# Altium project 48V-BuckConverter.PrjPcb
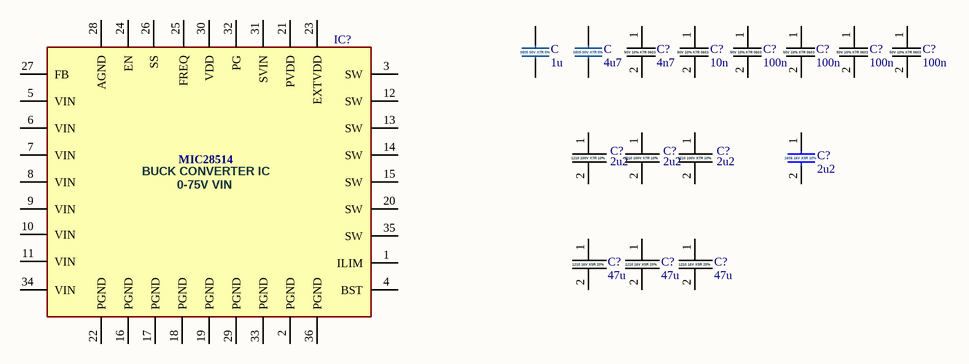
[diagram p0: BuckConverter-Main.SchDoc]
1 sheet, 16 parts. Net scope: global (net labels, ports and power ports of the same name join across sheets).

## Sheet BuckConverter-Main.SchDoc
size A4; SheetNumber: 1; SheetTotal: 1

### Parts
(Parts that share a designator on the sheet are numbered #1, #2 ... from top to bottom, then left to right.)
C#1  1u  [CAPC2012X95N]
C#2  4u7  [CAPC2012X95N]
C?#1  4n7  [C0603]
C?#2  10n  [C0603]
C?#3  100n  [C0603]
C?#4  100n  [C0603]
C?#5  100n  [C0603]
C?#6  100n  [C0603]
C?#7  2u2  [C1210]
C?#8  2u2  [C1210]
C?#9  2u2  [C1210]
C?#10  2u2  [CAPC1608X80N]
C?#11  47u  [C1210]
C?#12  47u  [C1210]
C?#13  47u  [C1210]
IC?  MIC28514  [MIC28514TEPHA]

### Nets

Not connected (* = marked no-connect by the designer): C#1 1 2; C#2 1 2; C?#1 1 2; C?#2 1 2; C?#3 1 2; C?#4 1 2; C?#5 1 2; C?#6 1 2; C?#7 1 2; C?#8 1 2; C?#9 1 2; C?#10 1 2; C?#11 1 2; C?#12 1 2; C?#13 1 2; IC? 1(ILIM) 2(PGND) 3(SW) 4(BST) 5(VIN) 6(VIN) 7(VIN) 8(VIN) 9(VIN) 10(VIN) 11(VIN) 12(SW) 13(SW) 14(SW) 15(SW) 16(PGND) 17(PGND) 18(PGND) 19(PGND) 20(SW) 21(PVDD) 22(PGND) 23(EXTVDD) 24(EN) 25(FREQ) 26(SS) 27(FB) 28(AGND) 29(PGND) 30(VDD) 31(SVIN) 32(PG) 33(PGND) 34(VIN) 35(SW) 36(PGND)

### Notes on the sheet
- (in symbol 0805-CAP) 0805 50V X7R 5%
- (in symbol C0603C472K5RACTU) 50V 10% X7R 0603
- (in symbol C1210C220J5GACTU) 1210 100V X7R 10%; 1210 16V X5R 20%
- (in symbol C1608X5R0J225K080AB) 1608 16V X5R 10%
- (in symbol MIC28514) BUCK CONVERTER IC; 0-75V VIN

### Library data of the parts
C#1 = 0805-CAP: C2012X7S2A105K125AB; Manufacturer_Name: YAGEO; Manufacturer_Part_Number: CC0805JRX7R9BB104; Datasheet Link: https://www.yageo.com/upload/media/product/productsearch/datasheet/mlcc/UPY-GPHC_X7R_6.3V-to-250V_23.pdf; Height: 0.95mm; Mouser Part Number: 603-CC805JRX7R9BB104; Mouser Price/Stock: https://www.mouser.co.uk/ProductDetail/YAGEO/CC0805JRX7R9BB104?qs=5q%252BqlK8CmJSDpHT%2Fzz27hw%3D%3D; Arrow Part Number: CC0805JRX7R9BB104; Arrow Price/Stock: https://www.arrow.com/en/products/cc0805jrx7r9bb104/yageo?utm_currency=USD&region=nac
C#2 = 0805-CAP: C2012X5R1E475M125AB; Manufacturer_Name: YAGEO; Manufacturer_Part_Number: CC0805JRX7R9BB104; Datasheet Link: https://www.yageo.com/upload/media/product/productsearch/datasheet/mlcc/UPY-GPHC_X7R_6.3V-to-250V_23.pdf; Height: 0.95mm; Mouser Part Number: 603-CC805JRX7R9BB104; Mouser Price/Stock: https://www.mouser.co.uk/ProductDetail/YAGEO/CC0805JRX7R9BB104?qs=5q%252BqlK8CmJSDpHT%2Fzz27hw%3D%3D; Arrow Part Number: CC0805JRX7R9BB104; Arrow Price/Stock: https://www.arrow.com/en/products/cc0805jrx7r9bb104/yageo?utm_currency=USD&region=nac
C?#1 = C0603C472K5RACTU: Manufacturer_Name: KEMET; Datasheet Link: https://content.kemet.com/datasheets/KEM_C1002_X7R_SMD.pdf; Height: 0.87mm; Manufacturer_Part_Number: C0603C472K5RACTU; Mouser Part Number: 80-C0603C472K5R; Mouser Price/Stock: https://www.mouser.co.uk/ProductDetail/KEMET/C0603C472K5RACTU?qs=PKwhJV00DjVWo4q%252BGYORqA%3D%3D; Arrow Part Number: C0603C472K5RACTU; Arrow Price/Stock: https://www.arrow.com/en/products/c0603c472k5ractu/kemet-corporation?region=nac
C?#2 = C0603C472K5RACTU: CC0603KRX7R8BB103; Manufacturer_Name: KEMET; Datasheet Link: https://content.kemet.com/datasheets/KEM_C1002_X7R_SMD.pdf; Height: 0.87mm; Manufacturer_Part_Number: C0603C472K5RACTU; Mouser Part Number: 80-C0603C472K5R; Mouser Price/Stock: https://www.mouser.co.uk/ProductDetail/KEMET/C0603C472K5RACTU?qs=PKwhJV00DjVWo4q%252BGYORqA%3D%3D; Arrow Part Number: C0603C472K5RACTU; Arrow Price/Stock: https://www.arrow.com/en/products/c0603c472k5ractu/kemet-corporation?region=nac
C?#3 = C0603C472K5RACTU: 0603YC104KAT2A; Manufacturer_Name: KEMET; Datasheet Link: https://content.kemet.com/datasheets/KEM_C1002_X7R_SMD.pdf; Height: 0.87mm; Manufacturer_Part_Number: C0603C472K5RACTU; Mouser Part Number: 80-C0603C472K5R; Mouser Price/Stock: https://www.mouser.co.uk/ProductDetail/KEMET/C0603C472K5RACTU?qs=PKwhJV00DjVWo4q%252BGYORqA%3D%3D; Arrow Part Number: C0603C472K5RACTU; Arrow Price/Stock: https://www.arrow.com/en/products/c0603c472k5ractu/kemet-corporation?region=nac
C?#4-C?#6 = C0603C472K5RACTU: GRM188R72A104KA35D; Manufacturer_Name: KEMET; Datasheet Link: https://content.kemet.com/datasheets/KEM_C1002_X7R_SMD.pdf; Height: 0.87mm; Manufacturer_Part_Number: C0603C472K5RACTU; Mouser Part Number: 80-C0603C472K5R; Mouser Price/Stock: https://www.mouser.co.uk/ProductDetail/KEMET/C0603C472K5RACTU?qs=PKwhJV00DjVWo4q%252BGYORqA%3D%3D; Arrow Part Number: C0603C472K5RACTU; Arrow Price/Stock: https://www.arrow.com/en/products/c0603c472k5ractu/kemet-corporation?region=nac
C?#7-C?#9 = C1210C220J5GACTU: C1210C225K1RACTU; Manufacturer_Name: KEMET; Datasheet Link: https://content.kemet.com/datasheets/KEM_C1003_C0G_SMD.pdf; Manufacturer_Part_Number: C1210C220J5GACTU; Mouser Part Number: 80-C1210C220J5G; Mouser Price/Stock: https://www.mouser.co.uk/ProductDetail/KEMET/C1210C220J5GACTU?qs=KoI833gIbpuZYp%252BGEpA%2FLw%3D%3D
C?#10 = C1608X5R0J225K080AB: C1608X5R1C225K; Manufacturer_Name: TDK; Description: TDK C1608 C 2.2uF Ceramic Multilayer Capacitor; Datasheet Link: https://product.tdk.com/info/en/catalog/datasheets/mlcc_commercial_midvoltage_en.pdf; Height: 0.8mm; Manufacturer_Part_Number: C1608X5R0J225K080AB; Mouser Part Number: 810-C1608X5R0J225K; Mouser Price/Stock: https://www.mouser.co.uk/ProductDetail/TDK/C1608X5R0J225K080AB?qs=NRhsANhppD%2FNiN6JLcM6Zg%3D%3D
C?#11-C?#13 = C1210C220J5GACTU: CC1210MKX5R7BB476; Manufacturer_Name: KEMET; Datasheet Link: https://content.kemet.com/datasheets/KEM_C1003_C0G_SMD.pdf; Manufacturer_Part_Number: C1210C220J5GACTU; Mouser Part Number: 80-C1210C220J5G; Mouser Price/Stock: https://www.mouser.co.uk/ProductDetail/KEMET/C1210C220J5GACTU?qs=KoI833gIbpuZYp%252BGEpA%2FLw%3D%3D
IC? = MIC28514: Integrated Circuit; Manufacturer_Name: Microchip; Manufacturer_Part_Number: MIC28514T-E/PHA; Datasheet Link: http://ww1.microchip.com/downloads/en/DeviceDoc/20005693C.pdf; Height: 0.9mm; Mouser Part Number: 579-MIC28514T-E/PHA; Mouser Price/Stock: https://www.mouser.co.uk/ProductDetail/Microchip-Technology/MIC28514T-E-PHA?qs=5aG0NVq1C4wZJlxKta95Xw%3D%3D; Arrow Part Number: MIC28514T-E/PHA; Arrow Price/Stock: https://www.arrow.com/en/products/mic28514t-epha/microchip-technology?utm_currency=USD&region=nac